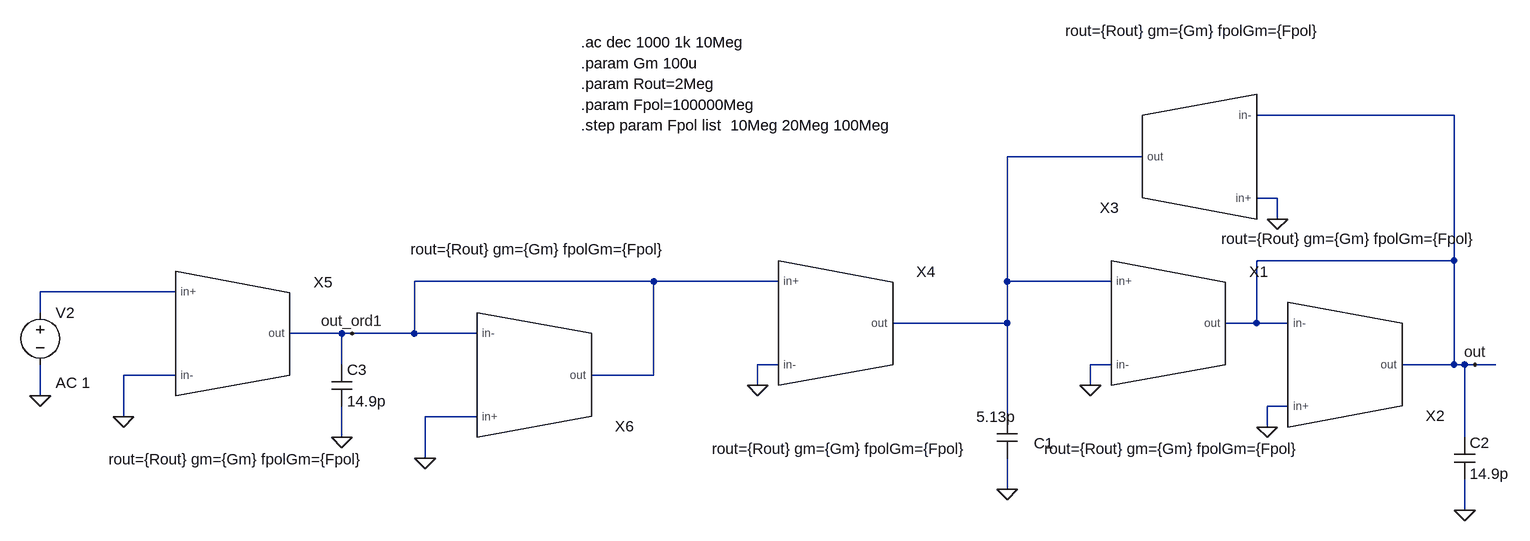
[diagram p0: schematic tb_FTJ_ord3_TowThomas_Gm_model.asc]
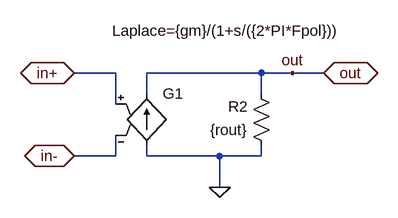
[diagram p1: sub-circuit gm_model.asc]
tb_FTJ_ord3_TowThomas_Gm_model.asc, the LTspice schematic file:
Version 4.1
SHEET 1 2760 1708
WIRE 1696 -160 1392 -160
WIRE 1216 -96 1008 -96
WIRE 1424 -32 1392 -32
WIRE 1424 0 1424 -32
WIRE 1696 64 1696 -160
WIRE 1696 64 1392 64
WIRE 464 96 96 96
WIRE 656 96 464 96
WIRE 1008 96 1008 -96
WIRE 1168 96 1008 96
WIRE -272 112 -480 112
WIRE -480 144 -480 112
WIRE 1008 160 1008 96
WIRE 1008 160 832 160
WIRE 1392 160 1392 64
WIRE 1392 160 1344 160
WIRE 1440 160 1392 160
WIRE -16 176 -96 176
WIRE 0 176 -16 176
WIRE 96 176 96 96
WIRE 96 176 0 176
WIRE 192 176 96 176
WIRE -16 224 -16 176
WIRE 656 224 624 224
WIRE 1168 224 1136 224
WIRE 1696 224 1696 64
WIRE 1696 224 1616 224
WIRE 1712 224 1696 224
WIRE 1728 224 1712 224
WIRE 1760 224 1728 224
WIRE -272 240 -352 240
WIRE 464 240 464 96
WIRE 464 240 368 240
WIRE 624 256 624 224
WIRE 1136 256 1136 224
WIRE -480 272 -480 224
WIRE 1440 288 1408 288
WIRE -352 304 -352 240
WIRE 192 304 112 304
WIRE 1008 304 1008 160
WIRE 1408 320 1408 288
WIRE -16 336 -16 288
WIRE 1712 336 1712 224
WIRE 112 368 112 304
WIRE 1008 416 1008 368
WIRE 1712 448 1712 400
FLAG 1728 224 out
FLAG 1712 448 0
FLAG 1008 416 0
FLAG 1136 256 0
FLAG 1408 320 0
FLAG 1424 0 0
FLAG 624 256 0
FLAG -480 272 0
FLAG 0 176 out_ord1
FLAG -16 336 0
FLAG -352 304 0
FLAG 112 368 0
DATAFLAG 1552 64 ""
SYMBOL cap 992 304 R0
WINDOW 3 -31 0 Left 2
WINDOW 0 57 41 Left 2
SYMATTR Value 5.13p
SYMATTR InstName C1
SYMBOL cap 1696 336 R0
SYMATTR InstName C2
SYMATTR Value 14.9p
SYMBOL Gm_model 1392 144 R0
WINDOW 39 -128 225 Bottom 2
SYMATTR SpiceLine rout={Rout} gm={Gm} fpolGm={Fpol}
SYMATTR InstName X1
SYMBOL Gm_model 1664 240 M180
WINDOW 39 -128 225 Bottom 2
SYMATTR SpiceLine rout={Rout} gm={Gm} fpolGm={Fpol}
SYMATTR InstName X2
SYMBOL Gm_model 1168 -80 R180
WINDOW 39 -128 225 Bottom 2
SYMATTR SpiceLine rout={Rout} gm={Gm} fpolGm={Fpol}
SYMATTR InstName X3
SYMBOL Gm_model 880 144 R0
WINDOW 39 -128 225 Bottom 2
SYMATTR SpiceLine rout={Rout} gm={Gm} fpolGm={Fpol}
SYMATTR InstName X4
SYMBOL voltage -480 128 R0
WINDOW 123 24 124 Left 2
WINDOW 39 0 0 Left 2
SYMATTR Value2 AC 1
SYMATTR InstName V2
SYMATTR Value ""
SYMBOL cap -32 224 R0
SYMATTR InstName C3
SYMATTR Value 14.9p
SYMBOL Gm_model -48 160 R0
WINDOW 39 -128 225 Bottom 2
SYMATTR SpiceLine rout={Rout} gm={Gm} fpolGm={Fpol}
SYMATTR InstName X5
SYMBOL Gm_model 416 256 M180
WINDOW 39 -128 225 Bottom 2
SYMATTR SpiceLine rout={Rout} gm={Gm} fpolGm={Fpol}
SYMATTR InstName X6
TEXT 352 -272 Left 2 !.ac dec 1000 1k 10Meg
TEXT 352 -240 Left 2 !.param Gm 100u
TEXT 352 -208 Left 2 !.param Rout=2Meg
TEXT 352 -176 Left 2 !.param Fpol=100000Meg
TEXT 352 -144 Left 2 !.step param Fpol list  10Meg 20Meg 100Meg

gm_model.asc, the sub-circuit schematic file:
Version 4
SHEET 1 2564 1736
WIRE 1248 208 1184 208
WIRE 1472 208 1296 208
WIRE 1520 208 1472 208
WIRE 1568 208 1520 208
WIRE 1296 240 1296 208
WIRE 1472 240 1472 208
WIRE 1248 256 1248 208
WIRE 1248 336 1248 304
WIRE 1248 336 1184 336
WIRE 1296 336 1296 320
WIRE 1408 336 1296 336
WIRE 1472 336 1472 320
WIRE 1472 336 1408 336
WIRE 1408 384 1408 336
FLAG 1520 208 out
FLAG 1568 208 out
IOPIN 1568 208 BiDir
FLAG 1184 208 in+
IOPIN 1184 208 BiDir
FLAG 1184 336 in-
IOPIN 1184 336 BiDir
FLAG 1408 384 0
SYMBOL g 1296 224 R0
WINDOW 3 -53 -81 Left 2
SYMATTR Value Laplace={gm}/(1+s/({2*PI*Fpol}))
SYMATTR InstName G1
SYMBOL res 1488 336 R180
WINDOW 0 36 76 Left 2
WINDOW 3 36 40 Left 2
SYMATTR InstName R2
SYMATTR Value {rout}

The netlist it stands for:
* tb_FTJ_ord3_TowThomas_Gm_model.asc
C1 N001 0 5.13p
C2 out 0 14.9p
X§X1 N001 0 out gm_model params: rout={Rout} gm={Gm} fpolGm={Fpol}
X§X2 0 out out gm_model params: rout={Rout} gm={Gm} fpolGm={Fpol}
X§X3 0 out N001 gm_model params: rout={Rout} gm={Gm} fpolGm={Fpol}
X§X4 out_ord1 0 N001 gm_model params: rout={Rout} gm={Gm} fpolGm={Fpol}
V2 N002 0 AC 1
C3 out_ord1 0 14.9p
X§X5 N002 0 out_ord1 gm_model params: rout={Rout} gm={Gm} fpolGm={Fpol}
X§X6 0 out_ord1 out_ord1 gm_model params: rout={Rout} gm={Gm} fpolGm={Fpol}

* block symbol definitions
.subckt gm_model in+ in- out
G1 0 out in+ in- Laplace={gm}/(1+s/({2*PI*Fpol}))
R2 0 out {rout}
.ends gm_model

.ac dec 1000 1k 10Meg
.param Gm 100u
.param Rout=2Meg
.param Fpol=100000Meg
.step param Fpol list  10Meg 20Meg 100Meg
.backanno
.end